# Altium schematic sheet Stepper Driver.SchDoc
size A
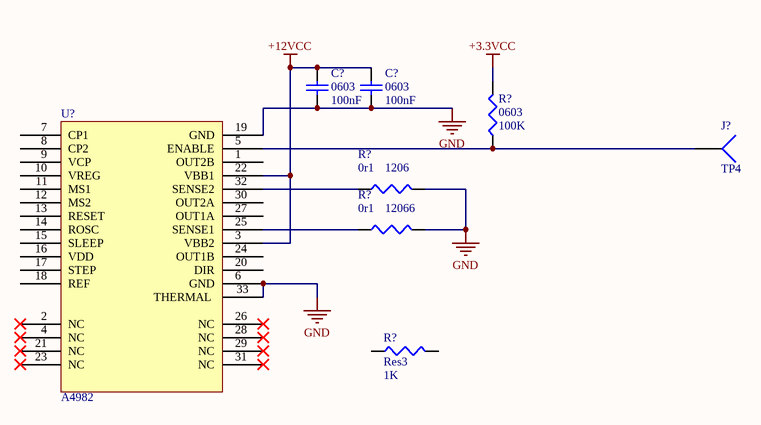
[diagram p0: Stepper Driver.SchDoc]

## Parts
(Parts that share a designator on the sheet are numbered #1, #2 ... from top to bottom, then left to right.)
C?#1  0603  value 100nF  [1608[0603]]
C?#2  0603  value 100nF  [1608[0603]]
J?  TP4  [PIN1]
R?#1  0603  value 100K  [J1-0603]
R?#2  1206  value 0r1  [1206 SMD Resistor]
R?#3  12066  value 0r1  [1206 SMD Resistor]
R?#4  Res3  value 1K  [J1-0603]
U?  A4982  [QFN50P508X508X100_HS-33N]

## Nets
+3.3VCC: R?#1.2
+12VCC: C?#1.2 C?#2.2 U?.3(VBB2) U?.22(VBB1)
GND: C?#1.1 C?#2.1 R?#2.2 R?#3.2 U?.6(GND) U?.19(GND) U?.33(THERMAL)
NetJ?_1: J?.1 R?#1.1 U?.5(ENABLE)
NetR?#2_1: R?#2.1 U?.32(SENSE2)
NetR?#3_1: R?#3.1 U?.25(SENSE1)

Not connected (* = marked no-connect by the designer): R?#4 1 2; U? 1(OUT2B) 2(NC)* 4(NC)* 7(CP1) 8(CP2) 9(VCP) 10(VREG) 11(MS1) 12(MS2) 13(RESET) 14(ROSC) 15(SLEEP) 16(VDD) 17(STEP) 18(REF) 20(DIR) 21(NC)* 23(NC)* 24(OUT1B) 26(NC)* 27(OUT1A) 28(NC)* 29(NC)* 30(OUT2A) 31(NC)*

## Library data of the parts
C?#1 C?#2 = Cap Semi: Capacitor (Semiconductor SIM Model); Published: 8-Jun-2000; LatestRevisionDate: 29-May-2009; LatestRevisionNote: IPC-7351 Footprint Added.; PackageReference: C1206; Publisher: Altium Limited; PackageDescription: Chip Capacitor
J? = Socket: LatestRevisionDate: 17-Jul-2002; LatestRevisionNote: Re-released for DXP Platform.; Publisher: Altium Limited
R?#1-R?#4 = Res3: Resistor; Published: 8-Jun-2000; LatestRevisionDate: 29-May-2009; LatestRevisionNote: IPC-7351 Footprint Added.; PackageReference: J1-0603; Publisher: Altium Limited; PackageDescription: Chip Resistor
U? = A4982: Alllegor A4982 Stepper Driver